# Altium schematic sheet 22_CONNECTOR_INTERFACE.SchDoc
size 420 x 297 mm; SheetNumber: 26; SheetTotal: 27
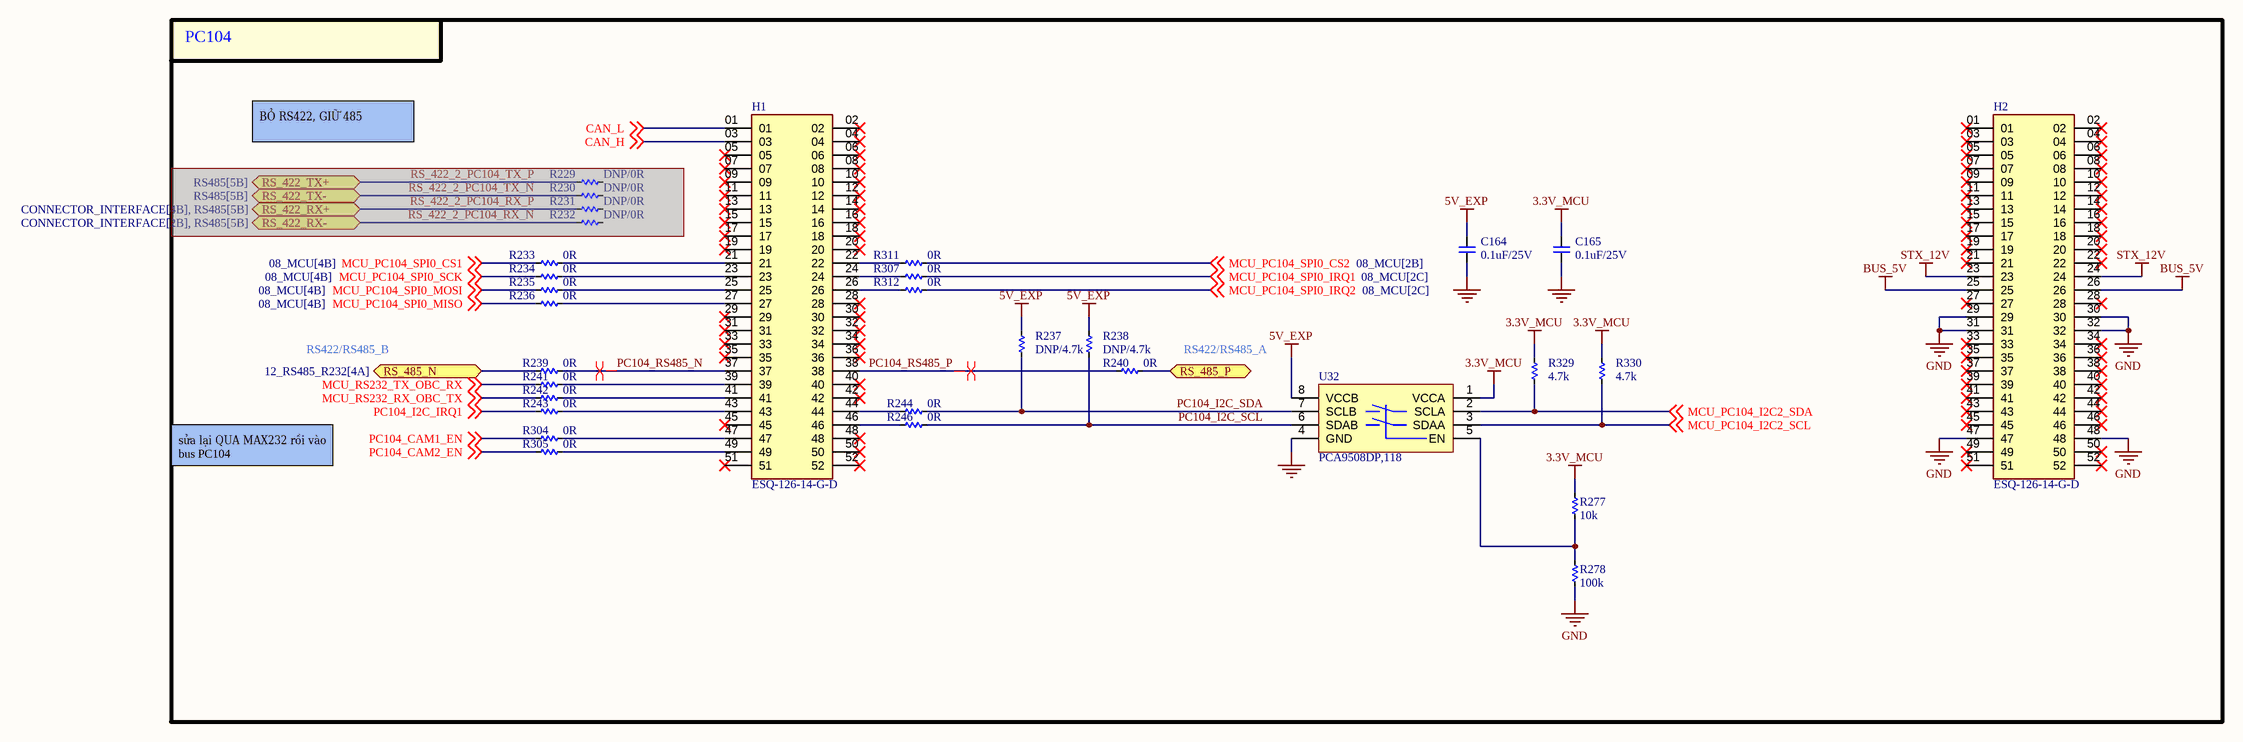
[diagram p0: 22_CONNECTOR_INTERFACE.SchDoc]

## Parts
C164  0.1uF/25V  [CAP_C_1005X60]
C165  0.1uF/25V  [CAP_C_1005X60]
H1  ESQ-126-14-G-D  [SAMTEC_ESQ-126-14-G-D]
H2  ESQ-126-14-G-D  [SAMTEC_ESQ-126-14-G-D]
R229  DNP/0R  [RES_C_1005X40]  (masked out: inside a compile mask, not in the netlist)
R230  DNP/0R  [RES_C_1005X40]  (masked out: inside a compile mask, not in the netlist)
R231  DNP/0R  [RES_C_1005X40]  (masked out: inside a compile mask, not in the netlist)
R232  DNP/0R  [RES_C_1005X40]  (masked out: inside a compile mask, not in the netlist)
R233  0R  [RES_C_1005X40]
R234  0R  [RES_C_1005X40]
R235  0R  [RES_C_1005X40]
R236  0R  [RES_C_1005X40]
R237  DNP/4.7k  [RES_C_1005X40]
R238  DNP/4.7k  [RES_C_1005X40]
R239  0R  [RES_C_1005X40]
R240  0R  [RES_C_1005X40]
R241  0R  [RES_C_1005X40]
R242  0R  [RES_C_1005X40]
R243  0R  [RES_C_1005X40]
R244  0R  [RES_C_1005X40]
R246  0R  [RES_C_1005X40]
R277  10k  [RES_C_1005X40]
R278  100k  [RES_C_1005X40]
R304  0R  [RES_C_1005X40]
R305  0R  [RES_C_1005X40]
R307  0R  [RES_C_1005X40]
R311  0R  [RES_C_1005X40]
R312  0R  [RES_C_1005X40]
R329  4.7k  [RES_C_1005X40]
R330  4.7k  [RES_C_1005X40]
U32  PCA9508DP,118  [TSOP8]

## Ports
RS_422_RX+ (bidir, see CONNECTOR_INTERFACE[4B], RS485[5B]), RS_422_RX- (bidir, see CONNECTOR_INTERFACE[2B], RS485[5B]), RS_422_TX+ (bidir, see RS485[5B]), RS_422_TX- (bidir, see RS485[5B]), RS_485_N (bidir, see 12_RS485_R232[4A]), RS_485_P (bidir, see 12_RS485_R232[4A])

## Nets
3.3V_MCU: C165.2 R277.1 R329.2 R330.2 U32.1(VCCA)
5V_EXP: C164.2 R237.2 R238.2 U32.8(VCCB)
BUS_5V: H2.25 H2.26
GND: C164.1 C165.1 H2.29 H2.30 H2.31 H2.32 H2.47 H2.48 R278.2 U32.4(GND)
STX_12V: H2.23 H2.24
CAN_H: H1.03 ; off-sheet CAN_H
CAN_L: H1.01 ; off-sheet CAN_L
MCU_PC104_I2C2_SCL: R330.1 U32.3(SDAA) ; off-sheet MCU_PC104_I2C2_SCL
MCU_PC104_I2C2_SDA: R329.1 U32.2(SCLA) ; off-sheet MCU_PC104_I2C2_SDA
MCU_PC104_SPI0_CS1: R233.1 ; off-sheet MCU_PC104_SPI0_CS1
MCU_PC104_SPI0_CS2: R311.1 ; off-sheet MCU_PC104_SPI0_CS2
MCU_PC104_SPI0_IRQ1: R307.2 ; off-sheet MCU_PC104_SPI0_IRQ1
MCU_PC104_SPI0_IRQ2: R312.2 ; off-sheet MCU_PC104_SPI0_IRQ2
MCU_PC104_SPI0_MISO: R236.1 ; off-sheet MCU_PC104_SPI0_MISO
MCU_PC104_SPI0_MOSI: R235.1 ; off-sheet MCU_PC104_SPI0_MOSI
MCU_PC104_SPI0_SCK: R234.1 ; off-sheet MCU_PC104_SPI0_SCK
MCU_RS232_RX_OBC_TX: R242.1 ; off-sheet MCU_RS232_RX_OBC_TX
MCU_RS232_TX_OBC_RX: R241.1 ; off-sheet MCU_RS232_TX_OBC_RX
PC104_CAM1_EN: R304.1 ; off-sheet PC104_CAM1_EN
PC104_CAM2_EN: R305.1 ; off-sheet PC104_CAM2_EN
PC104_I2C_IRQ1: R243.1 ; off-sheet PC104_I2C_IRQ1
PC104_I2C_SCL: R238.1 R246.2 U32.6(SDAB)
PC104_I2C_SDA: R237.1 R244.2 U32.7(SCLB)
PC104_RS485_N: H1.37 R239.2
PC104_RS485_P: H1.38 R240.1
RS_485_N: R239.1 ; port RS_485_N
RS_485_P: R240.2 ; port RS_485_P
NetH1_21: H1.21 R233.2
NetH1_22: H1.22 R311.2
NetH1_23: H1.23 R234.2
NetH1_24: H1.24 R307.1
NetH1_25: H1.25 R235.2
NetH1_26: H1.26 R312.1
NetH1_27: H1.27 R236.2
NetH1_39: H1.39 R241.2
NetH1_41: H1.41 R242.2
NetH1_43: H1.43 R243.2
NetH1_44: H1.44 R244.1
NetH1_46: H1.46 R246.1
NetH1_47: H1.47 R304.2
NetH1_49: H1.49 R305.2
NetR277_2: R277.2 R278.1 U32.5(EN)

Not connected (* = marked no-connect by the designer): H1 02* 04* 05* 06* 07* 08* 09* 10* 11* 12* 13* 14* 15* 16* 17* 18* 19* 20* 28* 29* 30* 31* 32* 33* 34* 35* 36* 40* 42* 45* 48* 50* 51* 52*; H2 01* 02* 03* 04* 05* 06* 07* 08* 09* 10* 11* 12* 13* 14* 15* 16* 17* 18* 19* 20* 21* 22* 27* 28* 33* 34* 35* 36* 37* 38* 39* 40* 41* 42* 43* 44* 45* 46* 49* 50* 51* 52*

## Layout directives
differential pair; differential pair class DIFF90; net class DIFF90; rule Matched Net Lengths [Tolerance = 4mil]: PC104_RS485_N, PC104_RS485_P

## Notes on the sheet
- PC104
- BỎ RS422, GIỮ 485
- RS422/RS485_B
- RS422/RS485_A
- sửa lại QUA MAX232 rồi vào bus PC104
- Project
- Sub-system:
- Design by:
- Sheet title:
- Sheet:
- of
- Checked by:
- Approved by:
- Doc no:
- Revision
- Size:
- Date:

## Library data of the parts
C164 C165 = _CAP_C_2: CAP
H1 H2 = ESQ-126-14-G-D: CONN SOCKET 52POS 0.1 GOLD PCB; MF: Samtec; MP: ESQ-126-14-G-D; Price: None; Package: None; Value: *; Availability: Unavailable
R229-R244 R246 R277 R278 R304 R305 R307 R311 R312 R329 R330 = _RES_B_2: RES